# Altium schematic sheet BASE.SchDoc: HDMI-MUX
size A4; SheetNumber: 2; SheetTotal: 5; DOC_NO_SCH_DWG: #012022051401
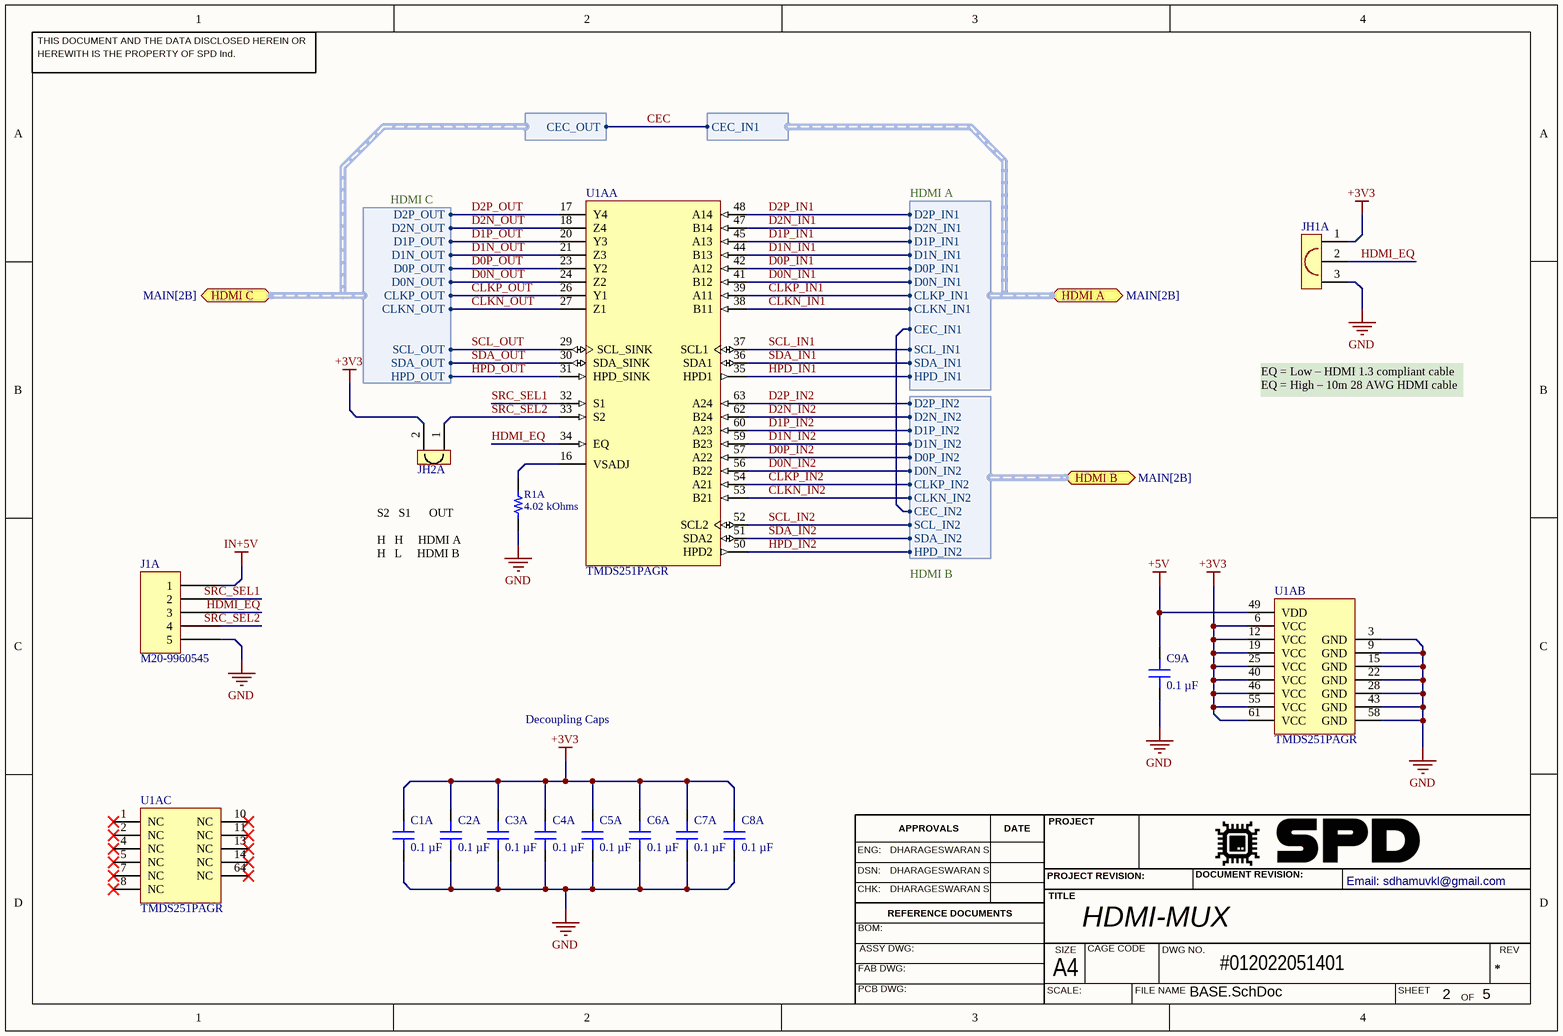
[diagram p0: BASE.SchDoc]

## Parts
C1A  0.1 µF  [CAP 0402_1005]
C2A  0.1 µF  [CAP 0402_1005]
C3A  0.1 µF  [CAP 0402_1005]
C4A  0.1 µF  [CAP 0402_1005]
C5A  0.1 µF  [CAP 0402_1005]
C6A  0.1 µF  [CAP 0402_1005]
C7A  0.1 µF  [CAP 0402_1005]
C8A  0.1 µF  [CAP 0402_1005]
C9A  0.1 µF  [CAP 0402_1005]
J1A  M20-9960545  [HARWIN M20-9960545]
JH1A  3PIN-JUMPER-RED  [JUMPER-3PIN-RED]  (value not drawn)
JH2A  2PIN-JUMPER-BLACK  [JUMPER-2PIN-BLACK]  (value not drawn)
R1A  4.02 kOhms  [RES 0402_1005]
U1A  TMDS251PAGR  [PAG0064A_L]  (parts A,B,C of 3)

## Ports
HDMI A (bidir, harness HDMI A, see MAIN[2B]), HDMI B (bidir, harness HDMI B, see MAIN[2B]), HDMI C (bidir, harness HDMI C, see MAIN[2B])

## Harnesses
HDMI A: D2P_IN1, D2N_IN1, D1P_IN1, D1N_IN1, D0P_IN1, D0N_IN1, CLKP_IN1, CLKN_IN1, SCL_IN1, SDA_IN1, HPD_IN1, CEC_IN1
HDMI B: D2P_IN2, D2N_IN2, D1P_IN2, D1N_IN2, D0P_IN2, D0N_IN2, CLKP_IN2, CLKN_IN2, SCL_IN2, SDA_IN2, HPD_IN2, CEC_IN2
HDMI C: D2P_OUT, D2N_OUT, D1P_OUT, D1N_OUT, D0P_OUT, D0N_OUT, CLKP_OUT, CLKN_OUT, SCL_OUT, SDA_OUT, HPD_OUT
HDMI C1: CEC_OUT
HDMI A1: CEC_IN1

## Nets
+3V3: C1A.2 C2A.2 C3A.2 C4A.2 C5A.2 C6A.2 C7A.2 C8A.2 JH1A.1 JH2A.2 U1A.6(VCC) U1A.12(VCC) U1A.19(VCC) U1A.25(VCC) U1A.40(VCC) U1A.46(VCC) U1A.55(VCC) U1A.61(VCC)
+5V: C9A.2 U1A.49(VDD)
GND: C1A.1 C2A.1 C3A.1 C4A.1 C5A.1 C6A.1 C7A.1 C8A.1 C9A.1 J1A.5 JH1A.3 R1A.1 U1A.3(GND) U1A.9(GND) U1A.15(GND) U1A.22(GND) U1A.28(GND) U1A.43(GND) U1A.58(GND)
IN+5V: J1A.1
CEC: port HDMI A.CEC_IN1, port HDMI B.CEC_IN2, port HDMI C.CEC_OUT
CLKN_IN1: U1A.38(B11) ; port HDMI A.CLKN_IN1
CLKN_IN2: U1A.53(B21) ; port HDMI B.CLKN_IN2
CLKN_OUT: U1A.27(Z1) ; port HDMI C.CLKN_OUT
CLKP_IN1: U1A.39(A11) ; port HDMI A.CLKP_IN1
CLKP_IN2: U1A.54(A21) ; port HDMI B.CLKP_IN2
CLKP_OUT: U1A.26(Y1) ; port HDMI C.CLKP_OUT
D0N_IN1: U1A.41(B12) ; port HDMI A.D0N_IN1
D0N_IN2: U1A.56(B22) ; port HDMI B.D0N_IN2
D0N_OUT: U1A.24(Z2) ; port HDMI C.D0N_OUT
D0P_IN1: U1A.42(A12) ; port HDMI A.D0P_IN1
D0P_IN2: U1A.57(A22) ; port HDMI B.D0P_IN2
D0P_OUT: U1A.23(Y2) ; port HDMI C.D0P_OUT
D1N_IN1: U1A.44(B13) ; port HDMI A.D1N_IN1
D1N_IN2: U1A.59(B23) ; port HDMI B.D1N_IN2
D1N_OUT: U1A.21(Z3) ; port HDMI C.D1N_OUT
D1P_IN1: U1A.45(A13) ; port HDMI A.D1P_IN1
D1P_IN2: U1A.60(A23) ; port HDMI B.D1P_IN2
D1P_OUT: U1A.20(Y3) ; port HDMI C.D1P_OUT
D2N_IN1: U1A.47(B14) ; port HDMI A.D2N_IN1
D2N_IN2: U1A.62(B24) ; port HDMI B.D2N_IN2
D2N_OUT: U1A.18(Z4) ; port HDMI C.D2N_OUT
D2P_IN1: U1A.48(A14) ; port HDMI A.D2P_IN1
D2P_IN2: U1A.63(A24) ; port HDMI B.D2P_IN2
D2P_OUT: U1A.17(Y4) ; port HDMI C.D2P_OUT
HDMI_EQ: J1A.3 JH1A.2 U1A.34(EQ)
HPD_IN1: U1A.35(HPD1) ; port HDMI A.HPD_IN1
HPD_IN2: U1A.50(HPD2) ; port HDMI B.HPD_IN2
HPD_OUT: U1A.31(HPD_SINK) ; port HDMI C.HPD_OUT
SCL_IN1: U1A.37(SCL1) ; port HDMI A.SCL_IN1
SCL_IN2: U1A.52(SCL2) ; port HDMI B.SCL_IN2
SCL_OUT: U1A.29(SCL_SINK) ; port HDMI C.SCL_OUT
SDA_IN1: U1A.36(SDA1) ; port HDMI A.SDA_IN1
SDA_IN2: U1A.51(SDA2) ; port HDMI B.SDA_IN2
SDA_OUT: U1A.30(SDA_SINK) ; port HDMI C.SDA_OUT
SRC_SEL1: J1A.2 U1A.32(S1)
SRC_SEL2: J1A.4 JH2A.1 U1A.33(S2)
NetR1A_2: R1A.2 U1A.16(VSADJ)

Not connected (* = marked no-connect by the designer): U1A 1(NC)* 2(NC)* 4(NC)* 5(NC)* 7(NC)* 8(NC)* 10(NC)* 11(NC)* 13(NC)* 14(NC)* 64(NC)*

## Notes on the sheet
- EQ = Low – HDMI 1.3 compliant cable
  EQ = High – 10m 28 AWG HDMI cable
- S2   S1      OUT
  H   H     HDMI A
  H   L     HDMI B
- Decoupling Caps
- THIS DOCUMENT AND THE DATA DISCLOSED HEREIN OR
- HEREWITH IS THE PROPERTY OF SPD Ind.
- ENG:
- DHARAGESWARAN S
- APPROVALS
- DATE
- PROJECT
- DSN:
- CHK:
- REFERENCE DOCUMENTS
- PROJECT REVISION:
- TITLE
- DOCUMENT REVISION:
- Email: sdhamuvkl@gmail.com <https://github.com/DhamuVkl>
- BOM:
- FAB DWG:
- PCB DWG:
- ASSY DWG:
- SCALE:
- A4
- SIZE
- CAGE CODE
- FILE NAME
- DWG NO.
- SHEET
- REV
- OF

## Library data of the parts
C1A C2A C3A C4A C5A C6A C7A C8A C9A = CL05B104KP5VPNC: CAP CER 100NF 10V X7R 0402; Manufacturer: Samsung Electro-Mechanics; id: 7736; Tolerance: ±10%; Part Number: CL05B104KP5VPNC; Value: 0.1 µF; Temperature Coefficient: X7R; Supplier Part Number 1: 1276-CL05B104KP5VPNCCT-ND; ComponentLink2Description: DigiKey Link; ComponentLink1URL: https://mm.digikey.com/Volume0/opasdata/d220001/medias/docus/5458/CL05B104KP5VPNC_Spec.pdf; PartId: 56690; Supplier 1: DigiKey; Series: CL; LastUpdated: 2023-11-05T20:02:55.743; Capacitance: 0.1 µF; Device Package: 0402 (1005 Metric); Ratings: AEC-Q200; Thickness (Max): 0.022" (0.55mm); Voltage - Rated: 10V; Minimum Order: 1; Packaging: TapeAndReel; Applications: Automotive; Package / Case: 0402 (1005 Metric); ComponentLink1Description: Datasheet; Price: 0.01; ComponentLink2URL: https://www.digikey.com/en/products/detail/samsung-electro-mechanics/CL05B104KP5VPNC/20498482; Lifecycle Status: Active; Operating Temperature: -55°C ~ 125°C; Size / Dimension: 0.039" L x 0.020" W (1.00mm x 0.50mm); Mounting Type: Surface Mount, MLCC
J1A = M20-9960545: CONN HEADER R/A 5POS 2.54MM; Manufacturer: Harwin Inc.; id: 168; Style: Board to Board or Cable; Current Rating (Amps): 3A per Contact; Contact Length - Mating: 0.240" (6.10mm); Connector Type: Header, Cuttable; Pitch - Mating: 0.100" (2.54mm); Number Of Positions: 5; Number Of Positions Loaded: All; Shrouding: Unshrouded; Material Flammability Rating: UL94 V-0; Row Spacing - Mating: -40°C ~ 105°C; Contact Length - Post: 0.118" (3.00mm); Part Number: M20-9960545; Supplier Part Number 1: 952-2246-ND; Contact Shape: Square; Termination: Solder; ComponentLink1Description: Datasheet; Contact Material: Brass; ComponentLink2URL: https://www.digikey.com/en/products/detail/harwin-inc/M20-9960545/3728210; Contact Finish - Mating: Gold; ComponentLink1URL: https://cdn.harwin.com/pdfs/Harwin_PC_Connectors_M20.pdf; Fastening Type: Push-Pull; Supplier 1: DigiKey; Number Of Rows: 1; Series: M20; Part Status: Active; ComponentLink2Description: DigiKey Link; Contact Type: Male Pin; Packaging: Bulk; Insulation Height: 0.100" (2.54mm); Minimum Order: 1; PartId: 168; Lifecycle Status: Active; LastUpdated: 2022-09-21T19:23:35.943; Operating Temperature: -40°C ~ 105°C; Insulation Color: Black; Mounting Type: Through Hole, Right Angle; Insulation Material: Polyamide (PA6T), Nylon 6T; Price: 0.14
R1A = CR0402-FX-4021GLF: RES SMD 4.02K OHM 1% 1/16W 0402; Manufacturer: Bourns Inc.; id: 2213; Temperature Coefficient: ±100ppm/°C; Power (Watts): 0.063W, 1/16W; Part Number: CR0402-FX-4021GLF; Height - Seated (Max): 0.016" (0.40mm); Supplier Part Number 1: CR0402-FX-4021GLFCT-ND; Supplier Device Package: 0402; ComponentLink1Description: Datasheet; ComponentLink2URL: https://www.digikey.com/en/products/detail/bourns-inc/CR0402-FX-4021GLF/3783361; ComponentLink1URL: https://www.bourns.com/docs/Product-Datasheets/CR0402.pdf; Composition: Thick Film; Tolerance: ±1%; Supplier 1: DigiKey; Series: CR0402; Part Status: Active; ComponentLink2Description: DigiKey Link; Device Package: 0402 (1005 Metric); Packaging: CutTape; Minimum Order: 1; Package / Case: 0402 (1005 Metric); PartId: 6644; Lifecycle Status: Active; LastUpdated: 2023-01-02T20:21:33.820; Operating Temperature: -55°C ~ 155°C; Number Of Terminations: 2; Value: 4.02 kOhms; Size / Dimension: 0.039" L x 0.020" W (1.00mm x 0.50mm); Price: 0.01; Resistance: 4.02 kOhms
U1A = CMP-0325-00084-3: 2.5 Gbps 2 to 1 DVI / HDMI Switch, 200 mA, 8 kV, 0 to +70 degC, 64-pin TQPF (PAG), Green (RoHS & no Sb/Br); Manufacturer: Texas Instruments; Data P-P Jitter(Max)(ps): 90; No. of TMDS Outputs: 1; No. of TMDS Inputs: 2; ESD HBM(kV): 8; TMDS Input Equalization: TRUE; Intra-Pair Skew(Max)(ps): 40; Inter-Pair Skew(Max)(ps): 65; Clock P-P Jitter(Max)(ps): 30; SubFamily: DVI/HDMI Repeater/Switch; ICC(Max)(mA): 200; PackageDescription: 64-Pin Thin Quad Flat Pack 0.5 mm Pitch; Eco-Plan: Green (RoHS & no Sb/Br); ComponentLink2Description: Datasheet; ComponentLink2URL: http://www.ti.com/general/docs/lit/getliterature.tsp?genericPartNumber=TMDS251&fileType=pdf; PackageReference: PAG0064A; DatasheetVersion: SLLS852A; PartNumber: TMDS251PAGR; ComponentLink1URL: http://www.ti.com/; ComponentLink1Description: Manufacturer URL; ComponentLink3URL: SamplesURL:http://www.ti.com/product/tmds251#samples; Mounting Technology: Surface Mount; ComponentLink3Description: URL Link1